# EAGLE design temp_module_v2.0_nov2023 (EAGLE 9.6.2)

## Sheet 1 of 2: Connectors
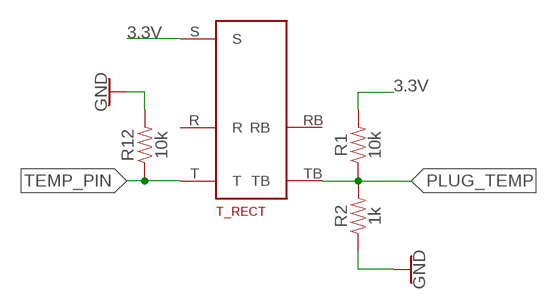
[diagram p0: schematic, sheet 1]

### Parts
R1  10k  10KOHM-0603-1/10W-1%  [0603]
R2  1k  1KOHM-0603-1/10W-1%  [0603]
R12  10k  10KOHM-0603-1/10W-1%  [0603]
T_RECT  SN37A1  [SN37A1]

### Nets
3.3V: R1.2 T_RECT.S ; also sheet 2
GND: R2.1 R12.2 ; also sheet 2
PLUG_TEMP: R1.1 R2.2 T_RECT.TB ; also sheet 2
TEMP_PIN: R12.1 T_RECT.T ; also sheet 2
Unconnected: T_RECT.R T_RECT.RB

## Sheet 2 of 2: Microcontroller
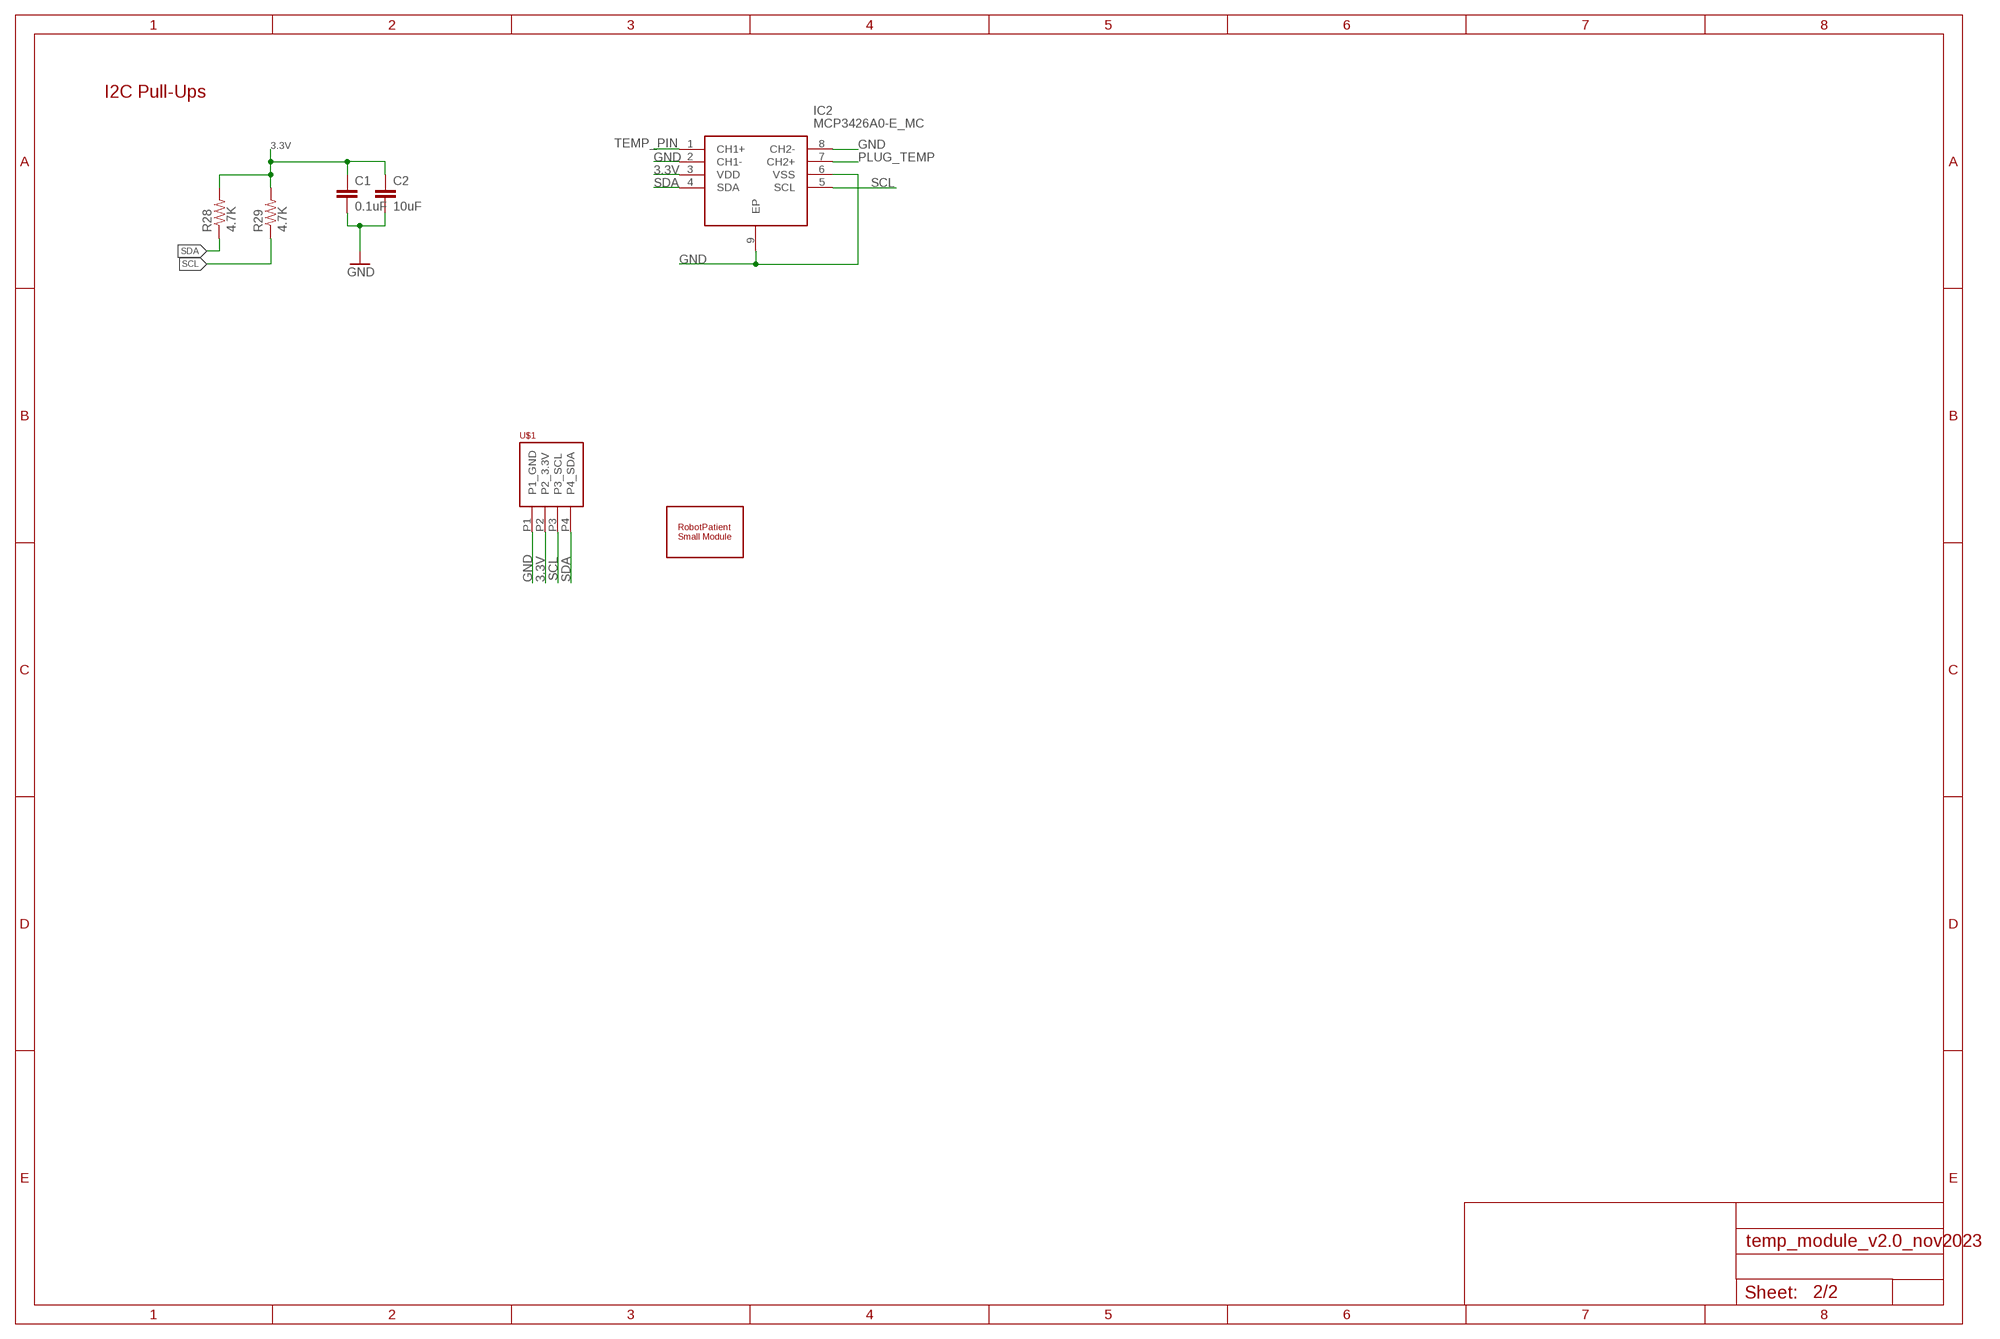
[diagram p1: schematic, sheet 2]

### Parts
C1  0.1uF  0.1UF-0603-25V-(+80/-20%)  [0603]
C2  10uF  10UF-0603-6.3V-20%  [0603]
IC2  MCP3426A0-E_MC  [SON50P300X200X100-9N]
R28  4.7K  4.7KOHM-1/10W-1%(0603)  [0603-RES]
R29  4.7K  4.7KOHM-1/10W-1%(0603)  [0603-RES]
U$1  PHOENIX_PTSM_M4_THANGLE  [PTSM_M4_TH]
U$2  ROBOTPATIENT_SMALL_MODULEBOARD  [RP_SMALL_SENSOR_OUTLINE]

### Nets
3.3V: C1.1 C2.1 IC2.3(VDD) R28.2 R29.2 U$1.P2(P2_3.3V) ; also sheet 1
GND: C1.2 C2.2 IC2.2(CH1-) IC2.6(VSS) IC2.8(CH2-) IC2.9(EP) U$1.P1(P1_GND) ; also sheet 1
PLUG_TEMP: IC2.7(CH2+) ; also sheet 1
SCL: IC2.5(SCL) R29.1 U$1.P3(P3_SCL)
SDA: IC2.4(SDA) R28.1 U$1.P4(P4_SDA)
TEMP_PIN: IC2.1(CH1+) ; also sheet 1

### Notes on the sheet
- I2C Pull-Ups

## Library data of the parts
C1 = SparkFun-Capacitors:0.1UF: 0.1µF ceramic capacitors A capacitor is a passive two-terminal electrical component used to store electrical energy temporarily in an electric field.; PROD_ID: CAP-00810
C2 = SparkFun-Capacitors:10UF: 10.0µF ceramic capacitors A capacitor is a passive two-terminal electrical component used to store electrical energy temporarily in an electric field.; PROD_ID: CAP-11015
IC2 = MCP3426A0-E_MC:MCP3426A0-E_MC: MICROCHIP - MCP3426A0-E/MC - Analogue to Digital Converter, 16 bit, 15 SPS, Differential, Single Ended, I2C, Single, 2.7 V Source: Datasheet <http://www.microchip.com/mymicrochip/filehandler.aspx?ddocname=en546216>; DESCRIPTION: MICROCHIP - MCP3426A0-E/MC - Analogue to Digital Converter, 16 bit, 15 SPS, Differential, Single Ended, I2C, Single, 2.7 V; HEIGHT: 1mm; MANUFACTURER_NAME: Microchip; MANUFACTURER_PART_NUMBER: MCP3426A0-E/MC; MOUSER_PART_NUMBER: 579-MCP3426A0E/MC; MOUSER_PRICE-STOCK: https://www.mouser.co.uk/ProductDetail/Microchip-Technology/MCP3426A0-E-MC?qs=icxrp76fIjCY1JH54pALjQ%3D%3D
R1 R12 = SparkFun-Resistors:10KOHM: 10kΩ resistor A resistor is a passive two-terminal electrical component that implements electrical resistance as a circuit element. Resistors act to reduce current flow, and, at the same time, act to lower voltage levels within circuits. - Wikipedia; PROD_ID: RES-00824
R2 = SparkFun-Resistors:1KOHM: 1kΩ resistor A resistor is a passive two-terminal electrical component that implements electrical resistance as a circuit element. Resistors act to reduce current flow, and, at the same time, act to lower voltage levels within circuits. - Wikipedia; PROD_ID: RES-07856
R28 R29 = SparkFun-Resistors:4.7KOHM-1/10W-1%(0603): RES-07857; PROD_ID: RES-07857
T_RECT = jk_customs:SN37A1: SN37A1 (SN37A11 / SN37A12A / SN37A12B / SN37A14B)
U$1 = jk_customs:PHOENIX_PTSM_M4_TH
U$2 = jk_customs:ROBOTPATIENT_SMALL_MODULE

## Board
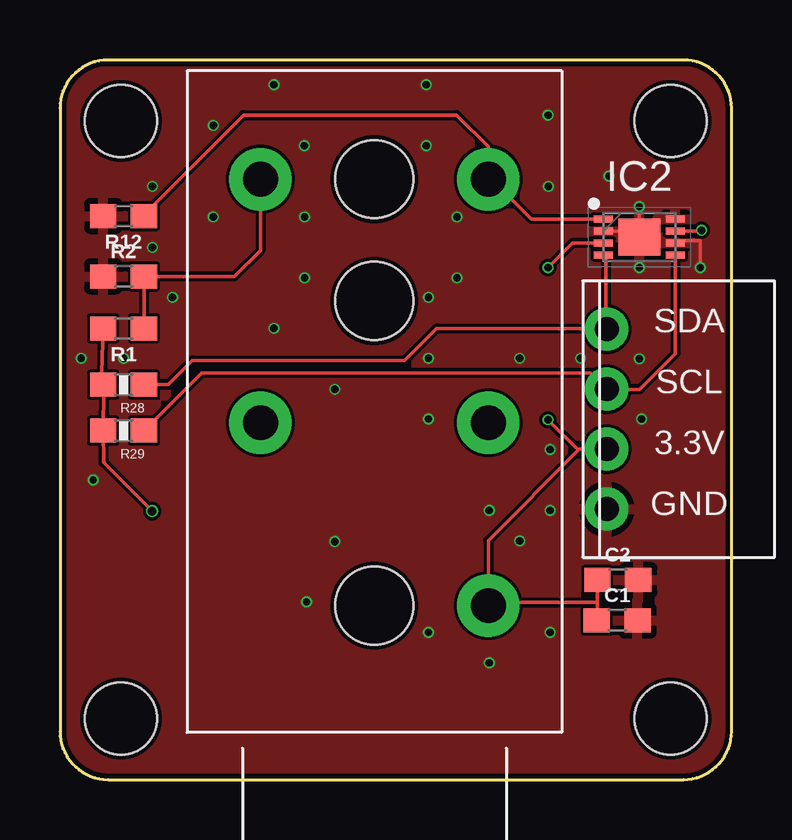
[diagram p2: board, top side]
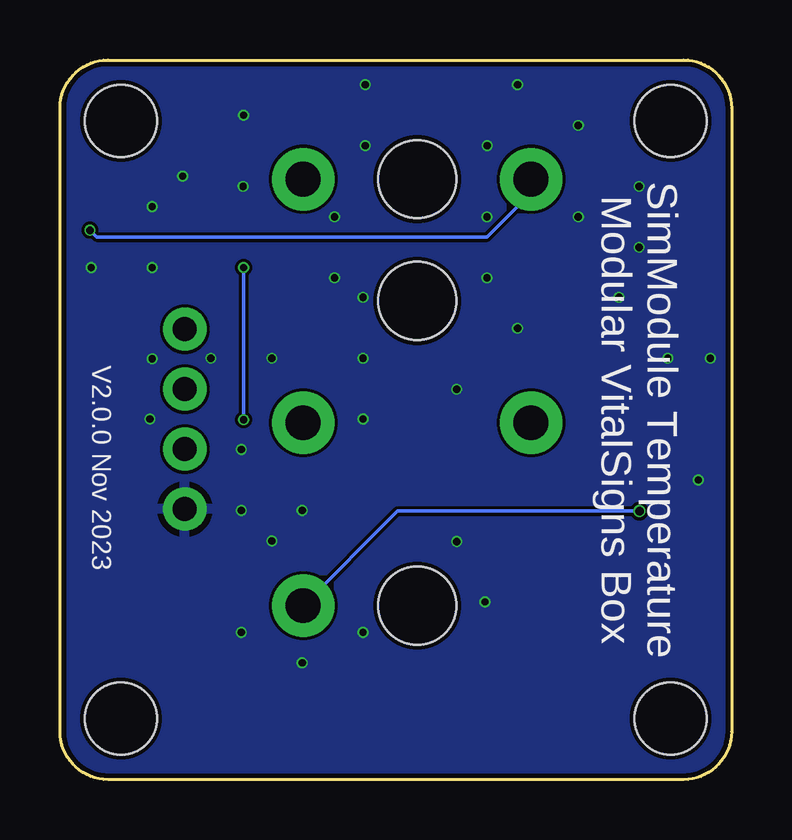
[diagram p3: board, bottom side, seen from below]

Size 28 x 30 mm. Coordinates in mm from the lower left corner, seen from the top.
Copper layers (1*16): Top 0.035mm / dielectric 1.6mm / Bottom 0.035mm
Design rules "jlcpcb-2layers_2023": minimum track width 5mil, minimum drill 0.3mm, track to track 5mil, track to pad 5mil, pad to pad 5mil, via to via 5mil, smd to smd 5mil, copper to edge 0.2mm, drill to drill 6mil, minimum pad ring 10mil, minimum via ring 3mil, stop-mask expansion 4mil, vias tented up to drill 20mil, thermal gap 10mil

### Footprints (pad centres in the part's own frame; a part is rotated, then mirrored left to right if it is on the bottom)
0603 = smd 1.1 x 1: 1 -0.85,0; 2 0.85,0
SON50P300X200X100-9N = smd 0.8 x 0.3: 1 -1.5,0.75; 2 -1.5,0.25; 3 -1.5,-0.25; 4 -1.5,-0.75; 5 1.5,-0.75; 6 1.5,-0.25; 7 1.5,0.25; 8 1.5,0.75 | smd 1.75 x 1.55: 9 0,0
0603-RES = smd 1.1 x 1: 1 -0.85,0; 2 0.85,0
SN37A1 = drill 1.448: R 10.16,4.75; RB 10.16,-4.75; S 17.78,4.75; T 0,4.75; TB 0,-4.75 | hole 3.251: 0,0; 5.08,0; 17.78,0
PTSM_M4_TH = drill 1: P1 3.75,1; P2 1.25,1; P3 -1.25,1; P4 -3.75,1
RP_SMALL_SENSOR_OUTLINE = hole 3: -11.455,12.455; 11.455,12.455; 11.455,-12.455; -11.455,-12.455

### Placement (x,y rotation side)
C1  23.23,6.63 0 top
C2  23.26,8.32 0 top
IC2  24.16,22.62 0 top
R1  2.65,18.81 180 top
R2  2.65,20.97 0 top
R12  2.65,23.5 180 top
R28  2.65,16.46 180 top
R29  2.65,14.54 180 top
T_RECT  13.11,25.03 270 top
U$1  21.79,15.03 270 top
U$2  14,15 0 top

### Tracks (layer width: path | path; a pad name or v marks a point on that pad's centre or on a via)
3.3V  (via drill 0.3, 0.35)
  Top 0.152: U$1.P2 21.66,13.78 21.62,13.73 | 21.62,13.73 17.86,9.97 T_RECT.S 17.99,7.38 22.41,7.38 | C2.1 22.41,7.38 | 22.41,7.38 22.41,6.66 C1.1 | v3.84,11.19 1.82,13.21 R29.2 1.82,16.27 | R28.2 1.82,16.42 1.82,16.27 | R1.2 1.72,16.37 1.82,16.27 | IC2.3 21.37,22.37 v20.35,21.35 | v20.35,15 21.62,13.73
  Bottom 0.152: T_RECT.S 13.92,11.19 v3.84,11.19 | v20.35,21.35 v20.35,15
GND  (via drill 0.3)
  Top 0.152: IC2.6 25.76,22.47 26.7,22.47 v26.7,21.35 | IC2.2 23.86,22.87 24.16,23.17 v24.16,23.89
  other vias: 8.92,18.81 10.19,26.43 15.27,26.43 15.27,28.97 8.92,28.97 20.35,27.7 22.89,25.16 24.16,21.35 24.16,17.54 11.46,16.27 11.46,9.92 15.36,17.57 15.36,20.11 15.36,15.03 19.17,9.95 17.9,11.22 20.44,6.14 17.9,4.87 15.36,6.14 10.28,7.41 1.39,12.49 2.66,17.57 0.88,17.57 4.69,20.11 3.85,22.19 3.85,24.73 6.39,27.27 6.39,23.46 10.2,23.46 10.2,20.92 16.55,23.46 16.55,20.92 20.36,24.73 19.17,17.57 21.71,17.57 24.25,15.03 20.44,13.76 20.44,11.22
  pour Top: -2.32,35.92 -2.32,-4.09 33.24,-4.09 33.24,37.89
  pour Bottom: -4.86,33.31 -4.86,-7.9 34.51,-7.9 34.51,35.49
PLUG_TEMP  (via drill 0.3)
  Top 0.152: R1.1 R2.2 7.27,20.97 8.36,22.06 T_RECT.TB | IC2.7 26.72,22.87 v26.75,22.9
  Bottom 0.152: v26.75,22.9 26.47,22.62 10.19,22.62 8.36,24.45 T_RECT.TB
SCL
  Top 0.152: R29.1 5.91,16.95 22.12,16.95 U$1.P3 24.16,16.27 25.66,17.77 IC2.5
SDA
  Top 0.152: R28.1 4.5,16.46 5.52,17.48 14.37,17.48 15.7,18.81 22.76,18.81 | 22.76,18.81 U$1.P4 | IC2.4 22.76,21.77 22.76,18.81
TEMP_PIN
  Top 0.152: R12.1 3.5,23.55 7.65,27.7 16.54,27.7 17.86,26.38 17.86,25.16 | 17.86,25.16 T_RECT.T | IC2.1 19.65,23.37 17.86,25.16

### Text on the board
_bsilk: SimModule Temperature / Modular VitalSigns Box